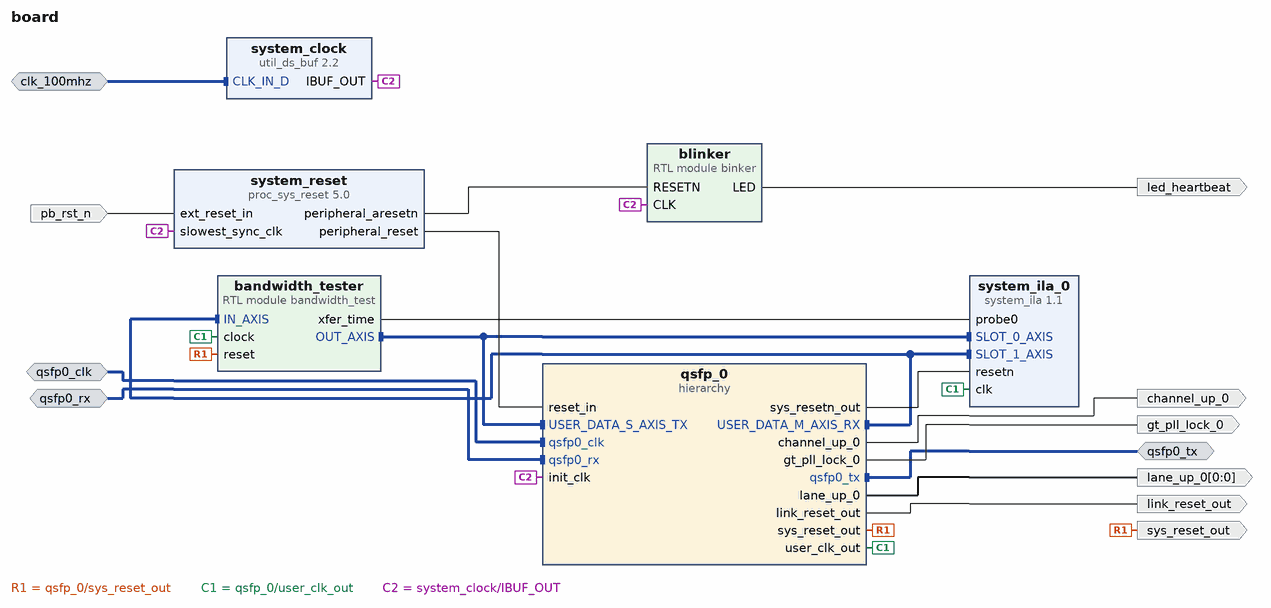
[diagram p0: block diagram of the top level]
# Vivado block design board, xczu19eg-ffvc1760-2-i, Vivado 2021.1
create_bd_design board

create_bd_intf_port -mode Slave -vlnv xilinx.com:interface:diff_clock_rtl:1.0 clk_100mhz
create_bd_intf_port -mode Slave -vlnv xilinx.com:interface:diff_clock_rtl:1.0 qsfp0_clk
set_property -dict {CONFIG.FREQ_HZ 322265625} [get_bd_intf_ports qsfp0_clk]
create_bd_intf_port -mode Slave -vlnv xilinx.com:display_aurora:GT_Serial_Transceiver_Pins_RX_rtl:1.0 qsfp0_rx
create_bd_intf_port -mode Master -vlnv xilinx.com:display_aurora:GT_Serial_Transceiver_Pins_TX_rtl:1.0 qsfp0_tx
create_bd_port -dir O led_heartbeat
create_bd_port -dir I -type rst pb_rst_n
create_bd_port -dir O gt_pll_lock_0
create_bd_port -dir O channel_up_0
create_bd_port -dir O -from 0 -to 0 lane_up_0
create_bd_port -dir O -type rst link_reset_out
set_property -dict {CONFIG.POLARITY ACTIVE_HIGH} [get_bd_ports link_reset_out]
create_bd_port -dir O -type rst sys_reset_out
set_property -dict {CONFIG.POLARITY ACTIVE_HIGH} [get_bd_ports sys_reset_out]

create_bd_cell -type ip -vlnv xilinx.com:ip:util_ds_buf:2.2 system_clock
create_bd_cell -type module -reference binker blinker
create_bd_cell -type ip -vlnv xilinx.com:ip:proc_sys_reset:5.0 system_reset
create_bd_cell -type module -reference bandwidth_test bandwidth_tester
create_bd_cell -type hier qsfp_0
create_bd_cell -type ip -vlnv xilinx.com:ip:system_ila:1.1 system_ila_0
set_property -dict [list \
  CONFIG.C_MON_TYPE MIX \
  CONFIG.C_NUM_MONITOR_SLOTS 2 \
  CONFIG.C_NUM_OF_PROBES 1 \
  CONFIG.C_PROBE0_TYPE 0 \
  CONFIG.C_SLOT_0_APC_EN 0 \
  CONFIG.C_SLOT_0_AXI_DATA_SEL 1 \
  CONFIG.C_SLOT_0_AXI_TRIG_SEL 1 \
  CONFIG.C_SLOT_0_INTF_TYPE xilinx.com:interface:axis_rtl:1.0 \
  CONFIG.C_SLOT_1_APC_EN 0 \
  CONFIG.C_SLOT_1_AXI_DATA_SEL 1 \
  CONFIG.C_SLOT_1_AXI_TRIG_SEL 1 \
  CONFIG.C_SLOT_1_INTF_TYPE xilinx.com:interface:axis_rtl:1.0 \
] [get_bd_cells system_ila_0]

# ---- hierarchy /qsfp_0 ----
current_bd_instance /qsfp_0
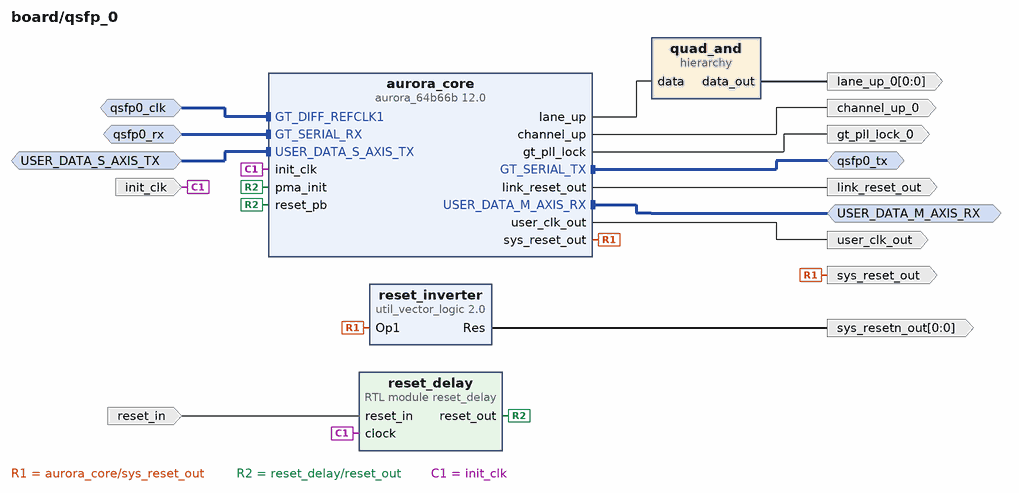
[diagram p1: block diagram inside /qsfp_0]
create_bd_intf_pin -mode Slave -vlnv xilinx.com:interface:axis_rtl:1.0 USER_DATA_S_AXIS_TX
create_bd_intf_pin -mode Master -vlnv xilinx.com:interface:axis_rtl:1.0 USER_DATA_M_AXIS_RX
create_bd_intf_pin -mode Slave -vlnv xilinx.com:interface:diff_clock_rtl:1.0 qsfp0_clk
create_bd_intf_pin -mode Master -vlnv xilinx.com:display_aurora:GT_Serial_Transceiver_Pins_TX_rtl:1.0 qsfp0_tx
create_bd_intf_pin -mode Slave -vlnv xilinx.com:display_aurora:GT_Serial_Transceiver_Pins_RX_rtl:1.0 qsfp0_rx
create_bd_pin -dir O channel_up_0
create_bd_pin -dir O gt_pll_lock_0
create_bd_pin -dir I -type clk init_clk
create_bd_pin -dir O -type rst link_reset_out
create_bd_pin -dir O -type clk user_clk_out
create_bd_pin -dir O -type rst sys_reset_out
create_bd_pin -dir O -from 0 -to 0 lane_up_0
create_bd_pin -dir O -from 0 -to 0 sys_resetn_out
create_bd_pin -dir I -type rst reset_in

create_bd_cell -type ip -vlnv xilinx.com:ip:aurora_64b66b:12.0 aurora_core
set_property -dict [list \
  CONFIG.CHANNEL_ENABLE {X0Y12 X0Y13 X0Y14 X0Y15} \
  CONFIG.C_AURORA_LANES 4 \
  CONFIG.C_GT_CLOCK_1 GTYQ0 \
  CONFIG.C_GT_TYPE GTY \
  CONFIG.C_LINE_RATE 25.78125 \
  CONFIG.C_REFCLK_FREQUENCY 322.265625 \
  CONFIG.C_REFCLK_SOURCE MGTREFCLK0_of_Quad_X0Y3 \
  CONFIG.C_START_LANE X0Y12 \
  CONFIG.C_START_QUAD Quad_X0Y3 \
  CONFIG.C_UCOLUMN_USED left \
  CONFIG.SupportLevel 1 \
  CONFIG.TransceiverControl false \
  CONFIG.drp_mode Disabled \
  CONFIG.interface_mode Streaming \
] [get_bd_cells aurora_core]
create_bd_cell -type hier quad_and
create_bd_cell -type ip -vlnv xilinx.com:ip:util_vector_logic:2.0 reset_inverter
set_property -dict {CONFIG.C_OPERATION not CONFIG.C_SIZE 1} [get_bd_cells reset_inverter]
create_bd_cell -type module -reference reset_delay reset_delay

# ---- hierarchy /qsfp_0/quad_and ----
current_bd_instance /qsfp_0/quad_and
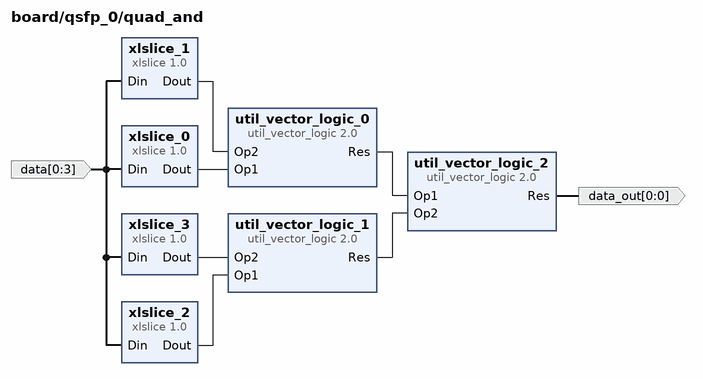
[diagram p2: block diagram inside /qsfp_0/quad_and]
create_bd_pin -dir I -from 0 -to 3 data
create_bd_pin -dir O -from 0 -to 0 data_out

create_bd_cell -type ip -vlnv xilinx.com:ip:util_vector_logic:2.0 util_vector_logic_0
set_property -dict {CONFIG.C_SIZE 1} [get_bd_cells util_vector_logic_0]
create_bd_cell -type ip -vlnv xilinx.com:ip:util_vector_logic:2.0 util_vector_logic_1
set_property -dict {CONFIG.C_SIZE 1} [get_bd_cells util_vector_logic_1]
create_bd_cell -type ip -vlnv xilinx.com:ip:util_vector_logic:2.0 util_vector_logic_2
set_property -dict {CONFIG.C_SIZE 1} [get_bd_cells util_vector_logic_2]
create_bd_cell -type ip -vlnv xilinx.com:ip:xlslice:1.0 xlslice_0
set_property -dict {CONFIG.DIN_WIDTH 4} [get_bd_cells xlslice_0]
create_bd_cell -type ip -vlnv xilinx.com:ip:xlslice:1.0 xlslice_1
set_property -dict {CONFIG.DIN_FROM 1 CONFIG.DIN_TO 1 CONFIG.DIN_WIDTH 4 CONFIG.DOUT_WIDTH 1} [get_bd_cells xlslice_1]
create_bd_cell -type ip -vlnv xilinx.com:ip:xlslice:1.0 xlslice_2
set_property -dict {CONFIG.DIN_FROM 2 CONFIG.DIN_TO 2 CONFIG.DIN_WIDTH 4 CONFIG.DOUT_WIDTH 1} [get_bd_cells xlslice_2]
create_bd_cell -type ip -vlnv xilinx.com:ip:xlslice:1.0 xlslice_3
set_property -dict {CONFIG.DIN_FROM 3 CONFIG.DIN_TO 3 CONFIG.DIN_WIDTH 4 CONFIG.DOUT_WIDTH 1} [get_bd_cells xlslice_3]

# ---- connections ----

current_bd_instance /qsfp_0
connect_bd_intf_net -intf_net GT_DIFF_REFCLK1_0_1 [get_bd_intf_pins qsfp0_clk] [get_bd_intf_pins aurora_core/GT_DIFF_REFCLK1]
connect_bd_intf_net -intf_net GT_SERIAL_RX_0_1 [get_bd_intf_pins qsfp0_rx] [get_bd_intf_pins aurora_core/GT_SERIAL_RX]
connect_bd_intf_net -intf_net aurora_64b66b_0_GT_SERIAL_TX [get_bd_intf_pins qsfp0_tx] [get_bd_intf_pins aurora_core/GT_SERIAL_TX]
connect_bd_intf_net -intf_net aurora_64b66b_0_USER_DATA_M_AXIS_RX [get_bd_intf_pins USER_DATA_M_AXIS_RX] [get_bd_intf_pins aurora_core/USER_DATA_M_AXIS_RX]
connect_bd_intf_net -intf_net bandwidth_test_0_OUT_AXIS [get_bd_intf_pins USER_DATA_S_AXIS_TX] [get_bd_intf_pins aurora_core/USER_DATA_S_AXIS_TX]
connect_bd_net -net aurora_64b66b_0_channel_up [get_bd_pins aurora_core/channel_up] [get_bd_pins channel_up_0]
connect_bd_net -net aurora_64b66b_0_gt_pll_lock [get_bd_pins aurora_core/gt_pll_lock] [get_bd_pins gt_pll_lock_0]
connect_bd_net -net aurora_64b66b_0_link_reset_out [get_bd_pins aurora_core/link_reset_out] [get_bd_pins link_reset_out]
connect_bd_net -net aurora_64b66b_0_sys_reset_out [get_bd_pins aurora_core/sys_reset_out] [get_bd_pins sys_reset_out] [get_bd_pins reset_inverter/Op1]
connect_bd_net -net aurora_64b66b_0_user_clk_out [get_bd_pins aurora_core/user_clk_out] [get_bd_pins user_clk_out]
connect_bd_net -net aurora_core_0_lane_up [get_bd_pins aurora_core/lane_up] [get_bd_pins quad_and/data]
connect_bd_net [get_bd_pins quad_and/data_out] [get_bd_pins lane_up_0]
connect_bd_net -net reset_delay_0_reset_out [get_bd_pins reset_delay/reset_out] [get_bd_pins aurora_core/pma_init] [get_bd_pins aurora_core/reset_pb]
connect_bd_net [get_bd_pins reset_in] [get_bd_pins reset_delay/reset_in]
connect_bd_net [get_bd_pins reset_inverter/Res] [get_bd_pins sys_resetn_out]
connect_bd_net -net system_clock_IBUF_OUT [get_bd_pins init_clk] [get_bd_pins aurora_core/init_clk] [get_bd_pins reset_delay/clock]
set_property HDL_ATTRIBUTE.DEBUG true [get_bd_intf_nets aurora_64b66b_0_USER_DATA_M_AXIS_RX]
set_property HDL_ATTRIBUTE.DEBUG true [get_bd_intf_nets bandwidth_test_0_OUT_AXIS]

current_bd_instance /qsfp_0/quad_and
connect_bd_net [get_bd_pins data] [get_bd_pins xlslice_0/Din] [get_bd_pins xlslice_1/Din] [get_bd_pins xlslice_2/Din] [get_bd_pins xlslice_3/Din]
connect_bd_net [get_bd_pins util_vector_logic_0/Res] [get_bd_pins util_vector_logic_2/Op1]
connect_bd_net [get_bd_pins util_vector_logic_1/Res] [get_bd_pins util_vector_logic_2/Op2]
connect_bd_net [get_bd_pins util_vector_logic_2/Res] [get_bd_pins data_out]
connect_bd_net [get_bd_pins xlslice_0/Dout] [get_bd_pins util_vector_logic_0/Op1]
connect_bd_net [get_bd_pins xlslice_1/Dout] [get_bd_pins util_vector_logic_0/Op2]
connect_bd_net [get_bd_pins xlslice_2/Dout] [get_bd_pins util_vector_logic_1/Op1]
connect_bd_net [get_bd_pins xlslice_3/Dout] [get_bd_pins util_vector_logic_1/Op2]

current_bd_instance /
connect_bd_intf_net -intf_net CLK_IN_D_0_1 [get_bd_intf_ports clk_100mhz] [get_bd_intf_pins system_clock/CLK_IN_D]
connect_bd_intf_net -intf_net GT_DIFF_REFCLK1_0_1 [get_bd_intf_ports qsfp0_clk] [get_bd_intf_pins qsfp_0/qsfp0_clk]
connect_bd_intf_net -intf_net GT_SERIAL_RX_0_1 [get_bd_intf_ports qsfp0_rx] [get_bd_intf_pins qsfp_0/qsfp0_rx]
connect_bd_intf_net -intf_net aurora_64b66b_0_GT_SERIAL_TX [get_bd_intf_ports qsfp0_tx] [get_bd_intf_pins qsfp_0/qsfp0_tx]
connect_bd_intf_net -intf_net aurora_64b66b_0_USER_DATA_M_AXIS_RX [get_bd_intf_pins qsfp_0/USER_DATA_M_AXIS_RX] [get_bd_intf_pins bandwidth_tester/IN_AXIS]
connect_bd_intf_net [get_bd_intf_pins qsfp_0/USER_DATA_M_AXIS_RX] [get_bd_intf_pins system_ila_0/SLOT_1_AXIS]
connect_bd_intf_net -intf_net bandwidth_test_0_OUT_AXIS [get_bd_intf_pins qsfp_0/USER_DATA_S_AXIS_TX] [get_bd_intf_pins bandwidth_tester/OUT_AXIS]
connect_bd_intf_net [get_bd_intf_pins qsfp_0/USER_DATA_S_AXIS_TX] [get_bd_intf_pins system_ila_0/SLOT_0_AXIS]
connect_bd_net -net aurora_64b66b_0_channel_up [get_bd_pins qsfp_0/channel_up_0] [get_bd_ports channel_up_0]
connect_bd_net -net aurora_64b66b_0_gt_pll_lock [get_bd_pins qsfp_0/gt_pll_lock_0] [get_bd_ports gt_pll_lock_0]
connect_bd_net -net aurora_64b66b_0_link_reset_out [get_bd_pins qsfp_0/link_reset_out] [get_bd_ports link_reset_out]
connect_bd_net -net aurora_64b66b_0_sys_reset_out [get_bd_pins qsfp_0/sys_reset_out] [get_bd_ports sys_reset_out] [get_bd_pins bandwidth_tester/reset]
connect_bd_net -net aurora_64b66b_0_user_clk_out [get_bd_pins qsfp_0/user_clk_out] [get_bd_pins bandwidth_tester/clock] [get_bd_pins system_ila_0/clk]
connect_bd_net -net binker_0_LED [get_bd_pins blinker/LED] [get_bd_ports led_heartbeat]
connect_bd_net -net ext_reset_in_0_1 [get_bd_ports pb_rst_n] [get_bd_pins system_reset/ext_reset_in]
# net gt_reset_out has one end: 
connect_bd_net [get_bd_pins qsfp_0/lane_up_0] [get_bd_ports lane_up_0]
connect_bd_net [get_bd_pins qsfp_0/sys_resetn_out] [get_bd_pins system_ila_0/resetn]
connect_bd_net [get_bd_pins system_clock/IBUF_OUT] [get_bd_pins blinker/CLK] [get_bd_pins system_reset/slowest_sync_clk] [get_bd_pins qsfp_0/init_clk]
connect_bd_net [get_bd_pins system_reset/peripheral_aresetn] [get_bd_pins blinker/RESETN]
connect_bd_net [get_bd_pins system_reset/peripheral_reset] [get_bd_pins qsfp_0/reset_in]
connect_bd_net -net xfer_time [get_bd_pins bandwidth_tester/xfer_time] [get_bd_pins system_ila_0/probe0]
set_property HDL_ATTRIBUTE.DEBUG true [get_bd_intf_nets aurora_64b66b_0_USER_DATA_M_AXIS_RX]
set_property HDL_ATTRIBUTE.MARK_DEBUG true [get_bd_intf_nets aurora_64b66b_0_USER_DATA_M_AXIS_RX]
set_property HDL_ATTRIBUTE.DEBUG true [get_bd_intf_nets bandwidth_test_0_OUT_AXIS]
set_property HDL_ATTRIBUTE.MARK_DEBUG true [get_bd_intf_nets bandwidth_test_0_OUT_AXIS]
set_property HDL_ATTRIBUTE.DEBUG true [get_bd_nets gt_reset_out]
set_property HDL_ATTRIBUTE.MARK_DEBUG true [get_bd_nets gt_reset_out]
set_property HDL_ATTRIBUTE.DEBUG true [get_bd_nets xfer_time]
set_property HDL_ATTRIBUTE.MARK_DEBUG true [get_bd_nets xfer_time]

validate_bd_design
save_bd_design
